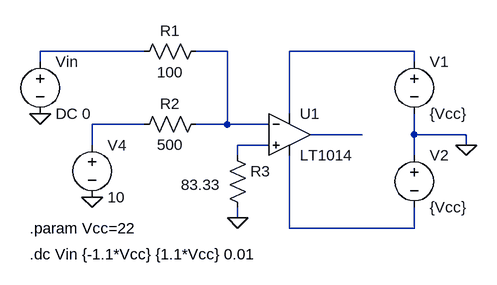
[diagram p0: schematic scheme6.asc]
scheme6.asc, the LTspice schematic file:
Version 4.1
SHEET 1 880 680
WIRE 48 32 -112 32
WIRE 176 32 128 32
WIRE 464 32 272 32
WIRE -112 48 -112 32
WIRE 464 48 464 32
WIRE 272 128 272 32
WIRE 48 144 -32 144
WIRE 176 144 176 32
WIRE 176 144 128 144
WIRE 240 144 176 144
WIRE 384 160 304 160
WIRE 464 160 464 128
WIRE 544 160 464 160
WIRE -32 176 -32 144
WIRE 240 176 192 176
WIRE 544 176 544 160
WIRE 192 192 192 176
WIRE 464 192 464 160
WIRE 192 288 192 272
WIRE 272 304 272 192
WIRE 464 304 464 272
WIRE 464 304 272 304
FLAG 544 176 0
FLAG 192 288 0
FLAG -112 128 0
FLAG -32 256 0
SYMBOL res 144 16 R90
WINDOW 0 0 56 VBottom 2
WINDOW 3 32 56 VTop 2
SYMATTR InstName R1
SYMATTR Value 100
SYMBOL res 144 128 R90
WINDOW 0 0 56 VBottom 2
WINDOW 3 32 56 VTop 2
SYMATTR InstName R2
SYMATTR Value 500
SYMBOL res 176 176 R0
WINDOW 3 -71 61 Left 2
SYMATTR InstName R3
SYMATTR Value 83.33
SYMBOL OpAmps\\LT1014 272 96 R0
SYMATTR InstName U1
SYMBOL voltage 464 32 R0
SYMATTR InstName V1
SYMATTR Value {Vcc}
SYMBOL voltage 464 176 R0
SYMATTR InstName V2
SYMATTR Value {Vcc}
SYMBOL voltage -112 32 R0
SYMATTR InstName Vin
SYMATTR Value DC 0
SYMBOL voltage -32 160 R0
SYMATTR InstName V4
SYMATTR Value 10
TEXT -128 304 Left 2 !.param Vcc=22
TEXT -128 344 Left 2 !.dc Vin {-1.1*Vcc} {1.1*Vcc} 0.01

The netlist it stands for:
* scheme6.asc
R1 N002 N001 100
R2 N002 N004 500
R3 N006 0 83.33
X§U1 N006 N002 N003 N007 N005 LT1014  ; pins In+ In- V+ V- OUT
V1 N003 0 {Vcc}
V2 0 N007 {Vcc}
Vin N001 0 DC 0
V4 N004 0 10
.param Vcc=22
.dc Vin {-1.1*Vcc} {1.1*Vcc} 0.01
.backanno
.end